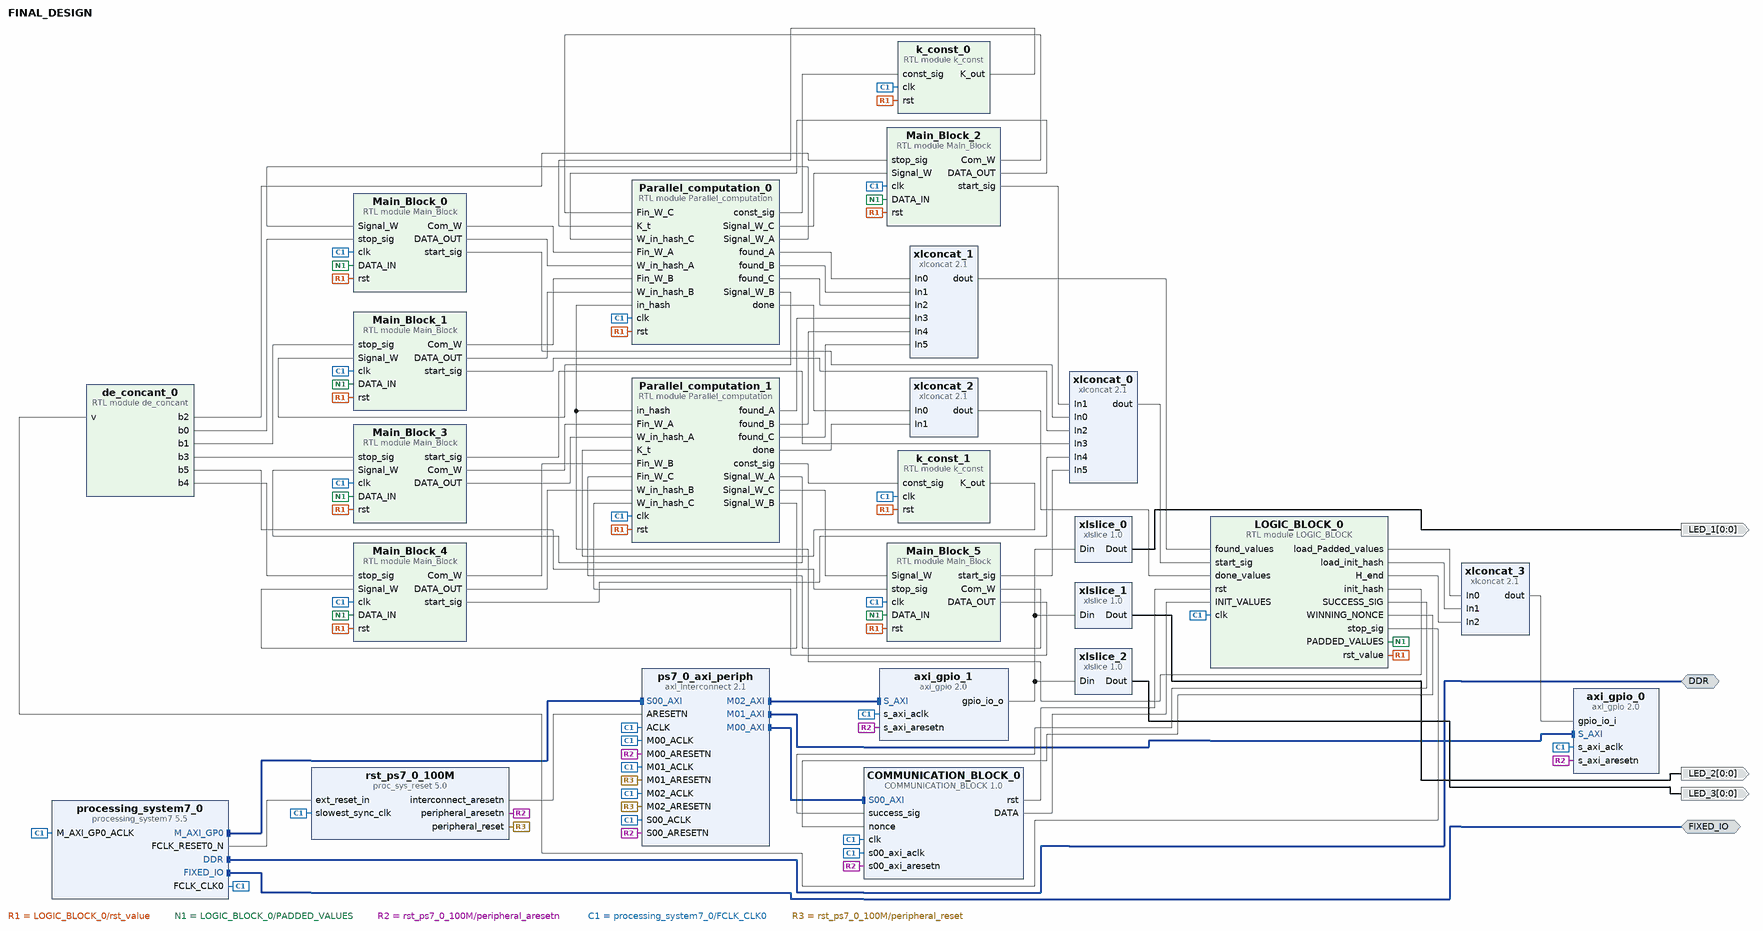
[diagram p0: block diagram of the top level]
# Vivado block design FINAL_DESIGN, xc7z020clg400-1, Vivado 2017.3
create_bd_design FINAL_DESIGN

create_bd_intf_port -mode Master -vlnv xilinx.com:interface:ddrx_rtl:1.0 DDR
create_bd_intf_port -mode Master -vlnv xilinx.com:display_processing_system7:fixedio_rtl:1.0 FIXED_IO
create_bd_port -dir O -from 0 -to 0 LED_1
create_bd_port -dir O -from 0 -to 0 LED_2
create_bd_port -dir O -from 0 -to 0 LED_3

create_bd_cell -type module -reference k_const k_const_0
create_bd_cell -type ip -vlnv xilinx.com:ip:xlconcat:2.1 xlconcat_0
set_property -dict {CONFIG.NUM_PORTS 6} [get_bd_cells xlconcat_0]
create_bd_cell -type ip -vlnv xilinx.com:ip:xlconcat:2.1 xlconcat_1
set_property -dict {CONFIG.NUM_PORTS 6} [get_bd_cells xlconcat_1]
create_bd_cell -type module -reference de_concant de_concant_0
create_bd_cell -type ip -vlnv xilinx.com:ip:xlconcat:2.1 xlconcat_2
set_property -dict {CONFIG.NUM_PORTS 2} [get_bd_cells xlconcat_2]
create_bd_cell -type module -reference k_const k_const_1
create_bd_cell -type module -reference Parallel_computation Parallel_computation_1
create_bd_cell -type module -reference Parallel_computation Parallel_computation_0
create_bd_cell -type module -reference LOGIC_BLOCK LOGIC_BLOCK_0
create_bd_cell -type module -reference Main_Block Main_Block_0
create_bd_cell -type module -reference Main_Block Main_Block_1
create_bd_cell -type module -reference Main_Block Main_Block_5
create_bd_cell -type module -reference Main_Block Main_Block_2
create_bd_cell -type module -reference Main_Block Main_Block_3
create_bd_cell -type module -reference Main_Block Main_Block_4
create_bd_cell -type ip -vlnv xilinx.com:ip:processing_system7:5.5 processing_system7_0
set_property -dict [list \
  CONFIG.PCW_UIPARAM_DDR_FREQ_MHZ 525 \
  CONFIG.PCW_CRYSTAL_PERIPHERAL_FREQMHZ 50 \
  CONFIG.PCW_APU_PERIPHERAL_FREQMHZ 650 \
  CONFIG.PCW_SDIO_PERIPHERAL_FREQMHZ 50 \
  CONFIG.PCW_UART_PERIPHERAL_FREQMHZ 100 \
  CONFIG.PCW_FPGA0_PERIPHERAL_FREQMHZ 100 \
  CONFIG.PCW_FPGA1_PERIPHERAL_FREQMHZ 50 \
  CONFIG.PCW_M_AXI_GP0_FREQMHZ 10 \
  CONFIG.PCW_PERIPHERAL_BOARD_PRESET None \
  CONFIG.PCW_PRESET_BANK1_VOLTAGE {LVCMOS 1.8V} \
  CONFIG.PCW_UIPARAM_DDR_BUS_WIDTH {16 Bit} \
  CONFIG.PCW_UIPARAM_DDR_PARTNO {MT41J256M16 RE-125} \
  CONFIG.PCW_QSPI_PERIPHERAL_ENABLE 1 \
  CONFIG.PCW_QSPI_QSPI_IO {MIO 1 .. 6} \
  CONFIG.PCW_QSPI_GRP_SINGLE_SS_ENABLE 1 \
  CONFIG.PCW_QSPI_GRP_SINGLE_SS_IO {MIO 1 .. 6} \
  CONFIG.PCW_SINGLE_QSPI_DATA_MODE x4 \
  CONFIG.PCW_QSPI_GRP_FBCLK_ENABLE 1 \
  CONFIG.PCW_QSPI_GRP_FBCLK_IO {MIO 8} \
  CONFIG.PCW_ENET0_PERIPHERAL_ENABLE 1 \
  CONFIG.PCW_ENET0_ENET0_IO {MIO 16 .. 27} \
  CONFIG.PCW_ENET0_GRP_MDIO_ENABLE 1 \
  CONFIG.PCW_ENET0_GRP_MDIO_IO {MIO 52 .. 53} \
  CONFIG.PCW_ENET_RESET_ENABLE 1 \
  CONFIG.PCW_ENET_RESET_SELECT {Share reset pin} \
  CONFIG.PCW_ENET0_RESET_ENABLE 1 \
  CONFIG.PCW_ENET0_RESET_IO {MIO 9} \
  CONFIG.PCW_SD0_PERIPHERAL_ENABLE 1 \
  CONFIG.PCW_SD0_SD0_IO {MIO 40 .. 45} \
  CONFIG.PCW_SD0_GRP_CD_ENABLE 1 \
  CONFIG.PCW_SD0_GRP_CD_IO {MIO 47} \
  CONFIG.PCW_SD0_GRP_WP_ENABLE 0 \
  CONFIG.PCW_UART0_PERIPHERAL_ENABLE 1 \
  CONFIG.PCW_UART0_UART0_IO {MIO 14 .. 15} \
  CONFIG.PCW_UART1_PERIPHERAL_ENABLE 0 \
  CONFIG.PCW_USB0_PERIPHERAL_ENABLE 1 \
  CONFIG.PCW_USB0_USB0_IO {MIO 28 .. 39} \
  CONFIG.PCW_USB_RESET_ENABLE 1 \
  CONFIG.PCW_USB_RESET_SELECT {Share reset pin} \
  CONFIG.PCW_USB0_RESET_ENABLE 1 \
  CONFIG.PCW_USB0_RESET_IO {MIO 46} \
  CONFIG.PCW_I2C_RESET_ENABLE 1 \
  CONFIG.PCW_GPIO_MIO_GPIO_ENABLE 1 \
  CONFIG.PCW_GPIO_MIO_GPIO_IO MIO \
] [get_bd_cells processing_system7_0]
# 481 more settings of processing_system7_0 are not shown: defaults, MIO pin electricals, DDR timing, and values the tool derives
create_bd_cell -type ip -vlnv xilinx.com:user:COMMUNICATION_BLOCK:1.0 COMMUNICATION_BLOCK_0
create_bd_cell -type ip -vlnv xilinx.com:ip:axi_interconnect:2.1 ps7_0_axi_periph
set_property -dict {CONFIG.NUM_MI 3} [get_bd_cells ps7_0_axi_periph]
create_bd_cell -type ip -vlnv xilinx.com:ip:proc_sys_reset:5.0 rst_ps7_0_100M
create_bd_cell -type ip -vlnv xilinx.com:ip:axi_gpio:2.0 axi_gpio_0
set_property -dict {CONFIG.C_GPIO_WIDTH 3 CONFIG.C_ALL_INPUTS 1} [get_bd_cells axi_gpio_0]
create_bd_cell -type ip -vlnv xilinx.com:ip:xlconcat:2.1 xlconcat_3
set_property -dict {CONFIG.NUM_PORTS 3} [get_bd_cells xlconcat_3]
create_bd_cell -type ip -vlnv xilinx.com:ip:axi_gpio:2.0 axi_gpio_1
set_property -dict {CONFIG.C_GPIO_WIDTH 3 CONFIG.C_ALL_INPUTS 0 CONFIG.C_ALL_OUTPUTS 1} [get_bd_cells axi_gpio_1]
create_bd_cell -type ip -vlnv xilinx.com:ip:xlslice:1.0 xlslice_0
set_property -dict {CONFIG.DIN_TO 0 CONFIG.DIN_FROM 0 CONFIG.DIN_WIDTH 3 CONFIG.DOUT_WIDTH 1} [get_bd_cells xlslice_0]
create_bd_cell -type ip -vlnv xilinx.com:ip:xlslice:1.0 xlslice_1
set_property -dict {CONFIG.DIN_TO 1 CONFIG.DIN_FROM 1 CONFIG.DIN_WIDTH 3 CONFIG.DOUT_WIDTH 1} [get_bd_cells xlslice_1]
create_bd_cell -type ip -vlnv xilinx.com:ip:xlslice:1.0 xlslice_2
set_property -dict {CONFIG.DIN_TO 2 CONFIG.DIN_FROM 2 CONFIG.DIN_WIDTH 3 CONFIG.DOUT_WIDTH 1} [get_bd_cells xlslice_2]

# ---- connections ----

connect_bd_intf_net [get_bd_intf_pins processing_system7_0/M_AXI_GP0] [get_bd_intf_pins ps7_0_axi_periph/S00_AXI]
connect_bd_intf_net [get_bd_intf_pins ps7_0_axi_periph/M00_AXI] [get_bd_intf_pins COMMUNICATION_BLOCK_0/S00_AXI]
connect_bd_intf_net [get_bd_intf_pins ps7_0_axi_periph/M01_AXI] [get_bd_intf_pins axi_gpio_0/S_AXI]
connect_bd_intf_net [get_bd_intf_pins ps7_0_axi_periph/M02_AXI] [get_bd_intf_pins axi_gpio_1/S_AXI]
connect_bd_intf_net [get_bd_intf_ports DDR] [get_bd_intf_pins processing_system7_0/DDR]
connect_bd_intf_net [get_bd_intf_ports FIXED_IO] [get_bd_intf_pins processing_system7_0/FIXED_IO]
connect_bd_net [get_bd_pins LOGIC_BLOCK_0/rst_value] \
  [get_bd_pins k_const_0/rst] [get_bd_pins k_const_1/rst] [get_bd_pins Parallel_computation_1/rst] \
  [get_bd_pins Parallel_computation_0/rst] [get_bd_pins Main_Block_0/rst] [get_bd_pins Main_Block_1/rst] \
  [get_bd_pins Main_Block_5/rst] [get_bd_pins Main_Block_2/rst] [get_bd_pins Main_Block_3/rst] [get_bd_pins Main_Block_4/rst]
connect_bd_net [get_bd_pins Main_Block_0/start_sig] [get_bd_pins xlconcat_0/In0]
connect_bd_net [get_bd_pins Main_Block_2/start_sig] [get_bd_pins xlconcat_0/In1]
connect_bd_net [get_bd_pins Main_Block_1/start_sig] [get_bd_pins xlconcat_0/In2]
connect_bd_net [get_bd_pins Parallel_computation_0/const_sig] [get_bd_pins k_const_0/const_sig]
connect_bd_net [get_bd_pins k_const_0/K_out] [get_bd_pins Parallel_computation_0/K_t]
connect_bd_net [get_bd_pins xlconcat_0/dout] [get_bd_pins LOGIC_BLOCK_0/start_sig]
connect_bd_net [get_bd_pins LOGIC_BLOCK_0/PADDED_VALUES] \
  [get_bd_pins Main_Block_0/DATA_IN] [get_bd_pins Main_Block_1/DATA_IN] [get_bd_pins Main_Block_5/DATA_IN] \
  [get_bd_pins Main_Block_2/DATA_IN] [get_bd_pins Main_Block_3/DATA_IN] [get_bd_pins Main_Block_4/DATA_IN]
connect_bd_net [get_bd_pins Main_Block_0/Com_W] [get_bd_pins Parallel_computation_0/Fin_W_A]
connect_bd_net [get_bd_pins Main_Block_1/Com_W] [get_bd_pins Parallel_computation_0/Fin_W_B]
connect_bd_net [get_bd_pins Main_Block_2/Com_W] [get_bd_pins Parallel_computation_0/Fin_W_C]
connect_bd_net [get_bd_pins Main_Block_0/DATA_OUT] [get_bd_pins Parallel_computation_0/W_in_hash_A]
connect_bd_net [get_bd_pins Main_Block_1/DATA_OUT] [get_bd_pins Parallel_computation_0/W_in_hash_B]
connect_bd_net [get_bd_pins Main_Block_2/DATA_OUT] [get_bd_pins Parallel_computation_0/W_in_hash_C]
connect_bd_net [get_bd_pins Parallel_computation_0/found_A] [get_bd_pins xlconcat_1/In0]
connect_bd_net [get_bd_pins Parallel_computation_0/found_B] [get_bd_pins xlconcat_1/In1]
connect_bd_net [get_bd_pins Parallel_computation_0/found_C] [get_bd_pins xlconcat_1/In2]
connect_bd_net [get_bd_pins xlconcat_1/dout] [get_bd_pins LOGIC_BLOCK_0/found_values]
connect_bd_net [get_bd_pins Parallel_computation_0/Signal_W_B] [get_bd_pins Main_Block_1/Signal_W]
connect_bd_net [get_bd_pins Parallel_computation_0/Signal_W_A] [get_bd_pins Main_Block_0/Signal_W]
connect_bd_net [get_bd_pins Parallel_computation_0/Signal_W_C] [get_bd_pins Main_Block_2/Signal_W]
connect_bd_net [get_bd_pins LOGIC_BLOCK_0/stop_sig] [get_bd_pins de_concant_0/v]
connect_bd_net [get_bd_pins de_concant_0/b0] [get_bd_pins Main_Block_0/stop_sig]
connect_bd_net [get_bd_pins de_concant_0/b1] [get_bd_pins Main_Block_1/stop_sig]
connect_bd_net [get_bd_pins de_concant_0/b2] [get_bd_pins Main_Block_2/stop_sig]
connect_bd_net [get_bd_pins Parallel_computation_0/done] [get_bd_pins xlconcat_2/In0]
connect_bd_net [get_bd_pins xlconcat_2/dout] [get_bd_pins LOGIC_BLOCK_0/done_values]
connect_bd_net [get_bd_pins LOGIC_BLOCK_0/init_hash] [get_bd_pins Parallel_computation_1/in_hash] [get_bd_pins Parallel_computation_0/in_hash]
connect_bd_net [get_bd_pins k_const_1/K_out] [get_bd_pins Parallel_computation_1/K_t]
connect_bd_net [get_bd_pins Main_Block_3/Com_W] [get_bd_pins Parallel_computation_1/Fin_W_A]
connect_bd_net [get_bd_pins Main_Block_4/Com_W] [get_bd_pins Parallel_computation_1/Fin_W_B]
connect_bd_net [get_bd_pins Main_Block_5/Com_W] [get_bd_pins Parallel_computation_1/Fin_W_C]
connect_bd_net [get_bd_pins Main_Block_3/DATA_OUT] [get_bd_pins Parallel_computation_1/W_in_hash_A]
connect_bd_net [get_bd_pins Main_Block_4/DATA_OUT] [get_bd_pins Parallel_computation_1/W_in_hash_B]
connect_bd_net [get_bd_pins Main_Block_5/DATA_OUT] [get_bd_pins Parallel_computation_1/W_in_hash_C]
connect_bd_net [get_bd_pins Main_Block_3/start_sig] [get_bd_pins xlconcat_0/In3]
connect_bd_net [get_bd_pins Main_Block_4/start_sig] [get_bd_pins xlconcat_0/In4]
connect_bd_net [get_bd_pins Main_Block_5/start_sig] [get_bd_pins xlconcat_0/In5]
connect_bd_net [get_bd_pins Parallel_computation_1/const_sig] [get_bd_pins k_const_1/const_sig]
connect_bd_net [get_bd_pins Parallel_computation_1/done] [get_bd_pins xlconcat_2/In1]
connect_bd_net [get_bd_pins Parallel_computation_1/found_A] [get_bd_pins xlconcat_1/In3]
connect_bd_net [get_bd_pins Parallel_computation_1/found_B] [get_bd_pins xlconcat_1/In4]
connect_bd_net [get_bd_pins Parallel_computation_1/found_C] [get_bd_pins xlconcat_1/In5]
connect_bd_net [get_bd_pins de_concant_0/b3] [get_bd_pins Main_Block_3/stop_sig]
connect_bd_net [get_bd_pins de_concant_0/b4] [get_bd_pins Main_Block_4/stop_sig]
connect_bd_net [get_bd_pins de_concant_0/b5] [get_bd_pins Main_Block_5/stop_sig]
connect_bd_net [get_bd_pins Parallel_computation_1/Signal_W_A] [get_bd_pins Main_Block_3/Signal_W]
connect_bd_net [get_bd_pins Parallel_computation_1/Signal_W_B] [get_bd_pins Main_Block_4/Signal_W]
connect_bd_net [get_bd_pins Parallel_computation_1/Signal_W_C] [get_bd_pins Main_Block_5/Signal_W]
connect_bd_net [get_bd_pins processing_system7_0/FCLK_RESET0_N] [get_bd_pins rst_ps7_0_100M/ext_reset_in]
connect_bd_net [get_bd_pins rst_ps7_0_100M/peripheral_aresetn] \
  [get_bd_pins COMMUNICATION_BLOCK_0/s00_axi_aresetn] [get_bd_pins ps7_0_axi_periph/S00_ARESETN] \
  [get_bd_pins ps7_0_axi_periph/M00_ARESETN] [get_bd_pins axi_gpio_0/s_axi_aresetn] [get_bd_pins axi_gpio_1/s_axi_aresetn]
connect_bd_net [get_bd_pins rst_ps7_0_100M/interconnect_aresetn] [get_bd_pins ps7_0_axi_periph/ARESETN]
connect_bd_net [get_bd_pins LOGIC_BLOCK_0/SUCCESS_SIG] [get_bd_pins COMMUNICATION_BLOCK_0/success_sig]
connect_bd_net [get_bd_pins LOGIC_BLOCK_0/WINNING_NONCE] [get_bd_pins COMMUNICATION_BLOCK_0/nonce]
connect_bd_net [get_bd_pins processing_system7_0/FCLK_CLK0] \
  [get_bd_pins processing_system7_0/M_AXI_GP0_ACLK] [get_bd_pins COMMUNICATION_BLOCK_0/s00_axi_aclk] \
  [get_bd_pins rst_ps7_0_100M/slowest_sync_clk] [get_bd_pins ps7_0_axi_periph/S00_ACLK] \
  [get_bd_pins ps7_0_axi_periph/M00_ACLK] [get_bd_pins ps7_0_axi_periph/ACLK] [get_bd_pins axi_gpio_0/s_axi_aclk] \
  [get_bd_pins axi_gpio_1/s_axi_aclk] [get_bd_pins ps7_0_axi_periph/M01_ACLK] [get_bd_pins ps7_0_axi_periph/M02_ACLK] \
  [get_bd_pins Main_Block_4/clk] [get_bd_pins k_const_0/clk] [get_bd_pins Parallel_computation_1/clk] \
  [get_bd_pins Main_Block_5/clk] [get_bd_pins Main_Block_2/clk] [get_bd_pins Parallel_computation_0/clk] \
  [get_bd_pins Main_Block_3/clk] [get_bd_pins Main_Block_0/clk] [get_bd_pins Main_Block_1/clk] [get_bd_pins k_const_1/clk] \
  [get_bd_pins COMMUNICATION_BLOCK_0/clk] [get_bd_pins LOGIC_BLOCK_0/clk]
connect_bd_net [get_bd_pins COMMUNICATION_BLOCK_0/rst] [get_bd_pins LOGIC_BLOCK_0/rst]
connect_bd_net [get_bd_pins COMMUNICATION_BLOCK_0/DATA] [get_bd_pins LOGIC_BLOCK_0/INIT_VALUES]
connect_bd_net [get_bd_pins LOGIC_BLOCK_0/load_Padded_values] [get_bd_pins xlconcat_3/In0]
connect_bd_net [get_bd_pins LOGIC_BLOCK_0/load_init_hash] [get_bd_pins xlconcat_3/In1]
connect_bd_net [get_bd_pins LOGIC_BLOCK_0/H_end] [get_bd_pins xlconcat_3/In2]
connect_bd_net [get_bd_pins xlconcat_3/dout] [get_bd_pins axi_gpio_0/gpio_io_i]
connect_bd_net [get_bd_pins axi_gpio_1/gpio_io_o] [get_bd_pins xlslice_0/Din] [get_bd_pins xlslice_1/Din] [get_bd_pins xlslice_2/Din]
connect_bd_net [get_bd_pins xlslice_0/Dout] [get_bd_ports LED_1]
connect_bd_net [get_bd_pins xlslice_1/Dout] [get_bd_ports LED_2]
connect_bd_net [get_bd_pins xlslice_2/Dout] [get_bd_ports LED_3]
connect_bd_net [get_bd_pins rst_ps7_0_100M/peripheral_reset] [get_bd_pins ps7_0_axi_periph/M01_ARESETN] [get_bd_pins ps7_0_axi_periph/M02_ARESETN]

# ---- address map ----
assign_bd_address -offset 0x41200000 -range 64K -target_address_space [get_bd_addr_spaces processing_system7_0/Data] [get_bd_addr_segs axi_gpio_0/S_AXI/Reg]
assign_bd_address -offset 0x41210000 -range 64K -target_address_space [get_bd_addr_spaces processing_system7_0/Data] [get_bd_addr_segs axi_gpio_1/S_AXI/Reg]
assign_bd_address -offset 0x43C00000 -range 64K -target_address_space [get_bd_addr_spaces processing_system7_0/Data] [get_bd_addr_segs COMMUNICATION_BLOCK_0/S00_AXI/S00_AXI_reg]

validate_bd_design
save_bd_design
